# Altium schematic sheet 05_GAP9_CHIP_GPIO.SchDoc: GAP9Shield
size A3; DrawnBy: Hanna Müller and Victor Kartsch; Organization: Integrated Systems Laboratory; DocumentNumber: 5; Revision: v1.0; SheetNumber: 5; SheetTotal: 9
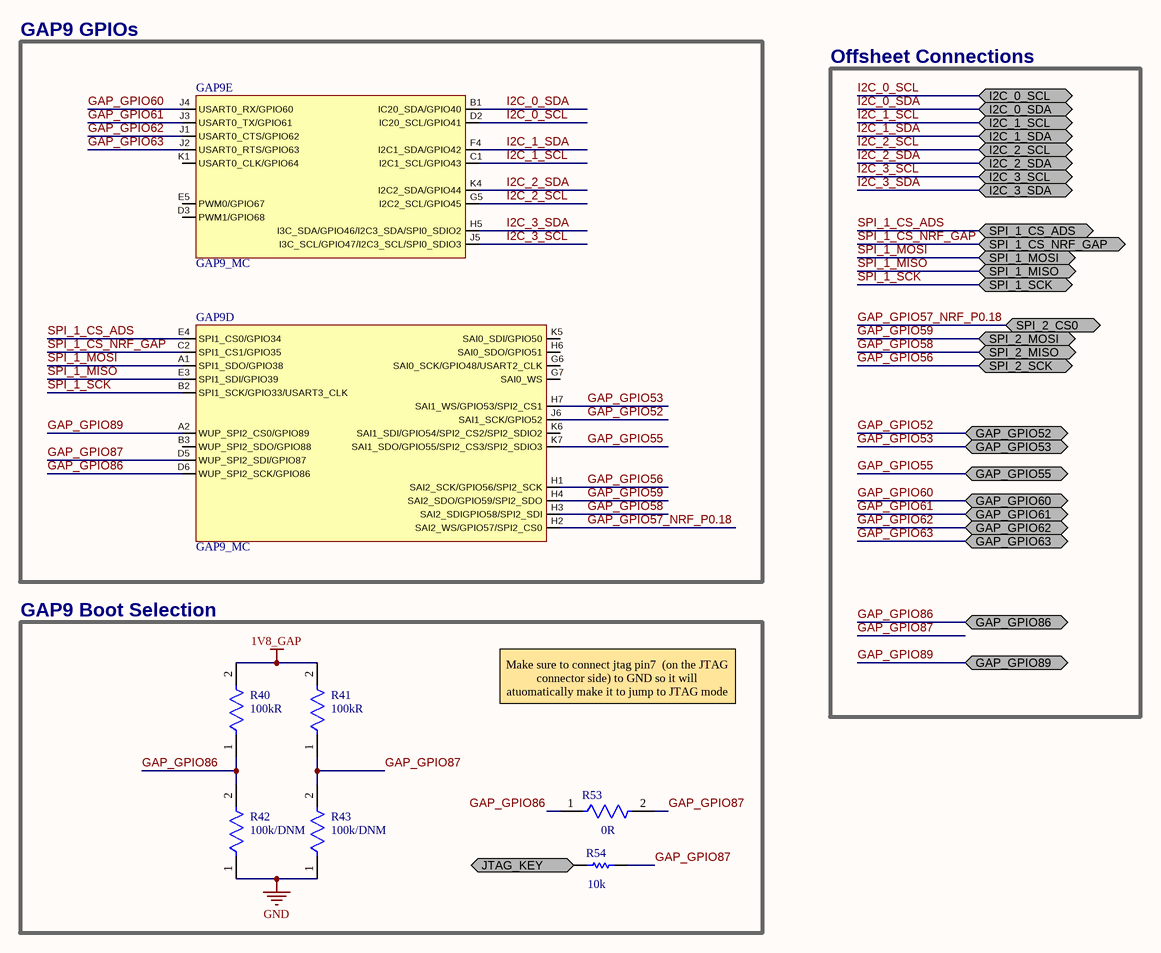
[diagram p0: 05_GAP9_CHIP_GPIO.SchDoc]

## Parts
GAP9  GAP9_MC  [GAP9]  (parts D,E of 5)
R40  value 100kR  [FP-ERJ1GN-IPC_A]  (hidden comment: ERJ-1GNF1003C)
R41  value 100kR  [FP-ERJ1GN-IPC_A]  (hidden comment: ERJ-1GNF1003C)
R42  value 100k/DNM  [FP-ERJ1GN-IPC_A]  (hidden comment: DNM)
R43  value 100k/DNM  [FP-ERJ1GN-IPC_A]  (hidden comment: DNM)
R53  value 0R  [FP-ERJ1GN-MFG]  (hidden comment: ERJ-1GN0R00C)
R54  value 10k  [RESC0603X28X15LL05T05]  (hidden comment: ERJ-U01F1001C)

## Blocks framed on the sheet
GAP9 GPIOs: GAP9
GAP9 Boot Selection: R40-R43 R53 R54

## Ports
GAP_GPIO52 (bidir), GAP_GPIO53 (bidir), GAP_GPIO55 (bidir), GAP_GPIO60 (bidir), GAP_GPIO61 (bidir), GAP_GPIO62 (bidir), GAP_GPIO63 (bidir), GAP_GPIO86 (bidir), GAP_GPIO89 (bidir), I2C_0_SCL (bidir), I2C_0_SDA (bidir), I2C_1_SCL (bidir), I2C_1_SDA (bidir), I2C_2_SCL (bidir), I2C_2_SDA (bidir), I2C_3_SCL (bidir), I2C_3_SDA (bidir), JTAG_KEY (bidir), SPI_1_CS_ADS (bidir), SPI_1_CS_NRF_GAP (bidir), SPI_1_MISO (bidir), SPI_1_MOSI (bidir), SPI_1_SCK (bidir), SPI_2_CS0 (bidir), SPI_2_MISO (bidir), SPI_2_MOSI (bidir), SPI_2_SCK (bidir)

## Nets
1V8_GAP: R40.2 R41.2
GND: R42.1 R43.1
GAP_GPIO52: GAP9.J6(SAI1_SCK/GPIO52) ; port GAP_GPIO52
GAP_GPIO53: GAP9.H7(SAI1_WS/GPIO53/SPI2_CS1) ; port GAP_GPIO53
GAP_GPIO55: GAP9.K7(SAI1_SDO/GPIO55/SPI2_CS3/SPI2_SDIO3) ; port GAP_GPIO55
GAP_GPIO56: GAP9.H1(SAI2_SCK/GPIO56/SPI2_SCK) ; port SPI_2_SCK
GAP_GPIO57_NRF_P0.18: GAP9.H2(SAI2_WS/GPIO57/SPI2_CS0) ; port SPI_2_CS0
GAP_GPIO58: GAP9.H3(SAI2_SDIGPIO58/SPI2_SDI) ; port SPI_2_MISO
GAP_GPIO59: GAP9.H4(SAI2_SDO/GPIO59/SPI2_SDO) ; port SPI_2_MOSI
GAP_GPIO60: GAP9.J4(USART0_RX/GPIO60) ; port GAP_GPIO60
GAP_GPIO61: GAP9.J3(USART0_TX/GPIO61) ; port GAP_GPIO61
GAP_GPIO62: GAP9.J1(USART0_CTS/GPIO62) ; port GAP_GPIO62
GAP_GPIO63: GAP9.J2(USART0_RTS/GPIO63) ; port GAP_GPIO63
GAP_GPIO86: GAP9.D6(WUP_SPI2_SCK/GPIO86) R40.1 R42.2 R53.1 ; port GAP_GPIO86
GAP_GPIO87: GAP9.D5(WUP_SPI2_SDI/GPIO87) R41.1 R43.2 R53.2 R54.2
GAP_GPIO89: GAP9.A2(WUP_SPI2_CS0/GPIO89) ; port GAP_GPIO89
I2C_0_SCL: GAP9.D2(IC20_SCL/GPIO41) ; port I2C_0_SCL
I2C_0_SDA: GAP9.B1(IC20_SDA/GPIO40) ; port I2C_0_SDA
I2C_1_SCL: GAP9.C1(I2C1_SCL/GPIO43) ; port I2C_1_SCL
I2C_1_SDA: GAP9.F4(I2C1_SDA/GPIO42) ; port I2C_1_SDA
I2C_2_SCL: GAP9.G5(I2C2_SCL/GPIO45) ; port I2C_2_SCL
I2C_2_SDA: GAP9.K4(I2C2_SDA/GPIO44) ; port I2C_2_SDA
I2C_3_SCL: GAP9.J5(I3C_SCL/GPIO47/I2C3_SCL/SPI0_SDIO3) ; port I2C_3_SCL
I2C_3_SDA: GAP9.H5(I3C_SDA/GPIO46/I2C3_SDA/SPI0_SDIO2) ; port I2C_3_SDA
JTAG_KEY: R54.1 ; port JTAG_KEY
SPI_1_CS_ADS: GAP9.E4(SPI1_CS0/GPIO34) ; port SPI_1_CS_ADS
SPI_1_CS_NRF_GAP: GAP9.C2(SPI1_CS1/GPIO35) ; port SPI_1_CS_NRF_GAP
SPI_1_MISO: GAP9.E3(SPI1_SDI/GPIO39) ; port SPI_1_MISO
SPI_1_MOSI: GAP9.A1(SPI1_SDO/GPIO38) ; port SPI_1_MOSI
SPI_1_SCK: GAP9.B2(SPI1_SCK/GPIO33/USART3_CLK) ; port SPI_1_SCK

Not connected (* = marked no-connect by the designer): GAP9 B3(WUP_SPI2_SDO/GPIO88) D3(PWM1/GPIO68) E5(PWM0/GPIO67) G6(SAI0_SCK/GPIO48/USART2_CLK) G7(SAI0_WS) H6(SAI0_SDO/GPIO51) K1(USART0_CLK/GPIO64) K5(SAI0_SDI/GPIO50) K6(SAI1_SDI/GPIO54/SPI2_CS2/SPI2_SDIO2)

## Notes on the sheet
- Offsheet Connections
- Make sure to connect jtag pin7  (on the JTAG connector side) to GND so it will atuomatically make it to jump to JTAG mode
- 1
- 2
- 3
- 4
- 5
- 6
- 7
- 8
- A
- B
- C
- D
- Project:
- Date:
- Drawing number:
- Rev:
- Format:
- A3
- Drawn by:
- Laboratory:
- Page
- Sheet:
- of
- File:

## Library data of the parts
R40-R43 = CMP-2004-03446-2: RES SMD 100K OHM 1% 1/20W 0201; Temperature Coefficient: 200ppm/°C; Voltage Rating: 25V; Max Power Dissipation: 50mW; Packaging: Tape and Reel; Tolerance: 1%; Mount: Surface Mount; Case Code (Metric): 0603; Number of Terminations: 2; Contact Plating: Tin; Case Code (Imperial): 0201; Width: 0.012inch; Lead Free: Lead Free; Radiation Hardening: No; Termination: SMD/SMT; Weight: 6E-06oz; Height: 0.01inch; Max Operating Temperature: 125°C; Number of Pins: 2; REACH SVHC: No SVHC; Power Rating: 50mW; Voltage Rating (DC): 25V; Package Quantity: 15000; Case/Package: 0201; Min Operating Temperature: -55°C; Length: 0.024inch; Composition: Thick Film
  R40 R41: Resistance: 100kR
  R42 R43: Resistance: 100k/DNM
R53 = CMP-1010-00001-3: RES SMD 0 OHM JUMPER 1/20W 0201; Temperature Coefficient: 600ppm/°C; Max Power Dissipation: 50mW; Voltage Rating: 25V; Tolerance: 1%; Package Quantity: 15000; Case Code (Imperial): 0201; Number of Terminations: 2; Depth: 0.3mm; Lead Free: Lead Free; Military Standard: Not; Width: 0.3mm; Resistance: 0R; Series: ERJ; Max Operating Temperature: 125°C; Construction: Rectangular; Contact Plating: Tin; RoHS Compliant: Yes; Height: 0.23mm; Voltage Rating (DC): 25V; Mount: Surface Mount; Min Operating Temperature: -55°C; Power Rating: 50mW; Features: Automotive AEC-Q200; Resistor Type: Thick Film; Case/Package: 0201; Case Code (Metric): 0603; Length: 0.6mm; Packaging: Tape and Reel
R54 = CMP-2004-00016-1: Manufacturer: Vishay Dale; Part Number: CRCW020110K0FNED